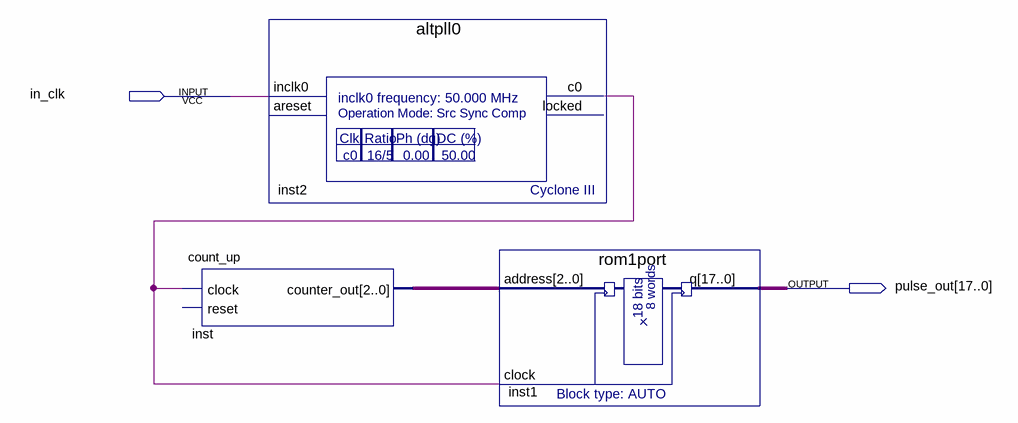
[diagram p0: schematic sheet]
// Quartus schematic RAM_Pulse_Gen_ver0_1_top.bdf as structural Verilog: 3 symbols, 2 pins
module RAM_Pulse_Gen_ver0_1_top (
  input  in_clk,
  output [17:0] pulse_out
);

  wire inst2_c0;
  wire [2:0] inst_counter_out;

  count_up inst (.clock(inst2_c0), .counter_out(inst_counter_out));  // open: reset
  altpll0 inst2 (.inclk0(in_clk), .c0(inst2_c0));  // open: areset, locked
  rom1port inst1 (.address(inst_counter_out), .clock(inst2_c0), .q(pulse_out));
endmodule
